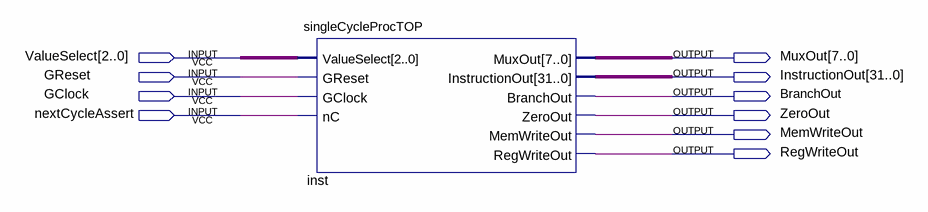
[diagram p0: schematic sheet]
// Quartus schematic top_level.bdf as structural Verilog: 1 symbols, 10 pins
module top_level (
  input  [2:0] ValueSelect,
  input  GReset,
  input  GClock,
  input  nextCycleAssert,
  output [7:0] MuxOut,
  output [31:0] InstructionOut,
  output BranchOut,
  output ZeroOut,
  output MemWriteOut,
  output RegWriteOut
);

  singleCycleProcTOP inst (
    .ValueSelect(ValueSelect), .GReset(GReset), .GClock(GClock), .nC(nextCycleAssert), .MuxOut(MuxOut),
    .InstructionOut(InstructionOut), .BranchOut(BranchOut), .ZeroOut(ZeroOut), .MemWriteOut(MemWriteOut),
    .RegWriteOut(RegWriteOut));
endmodule
